# EAGLE design LED_control (EAGLE 7.7.0)
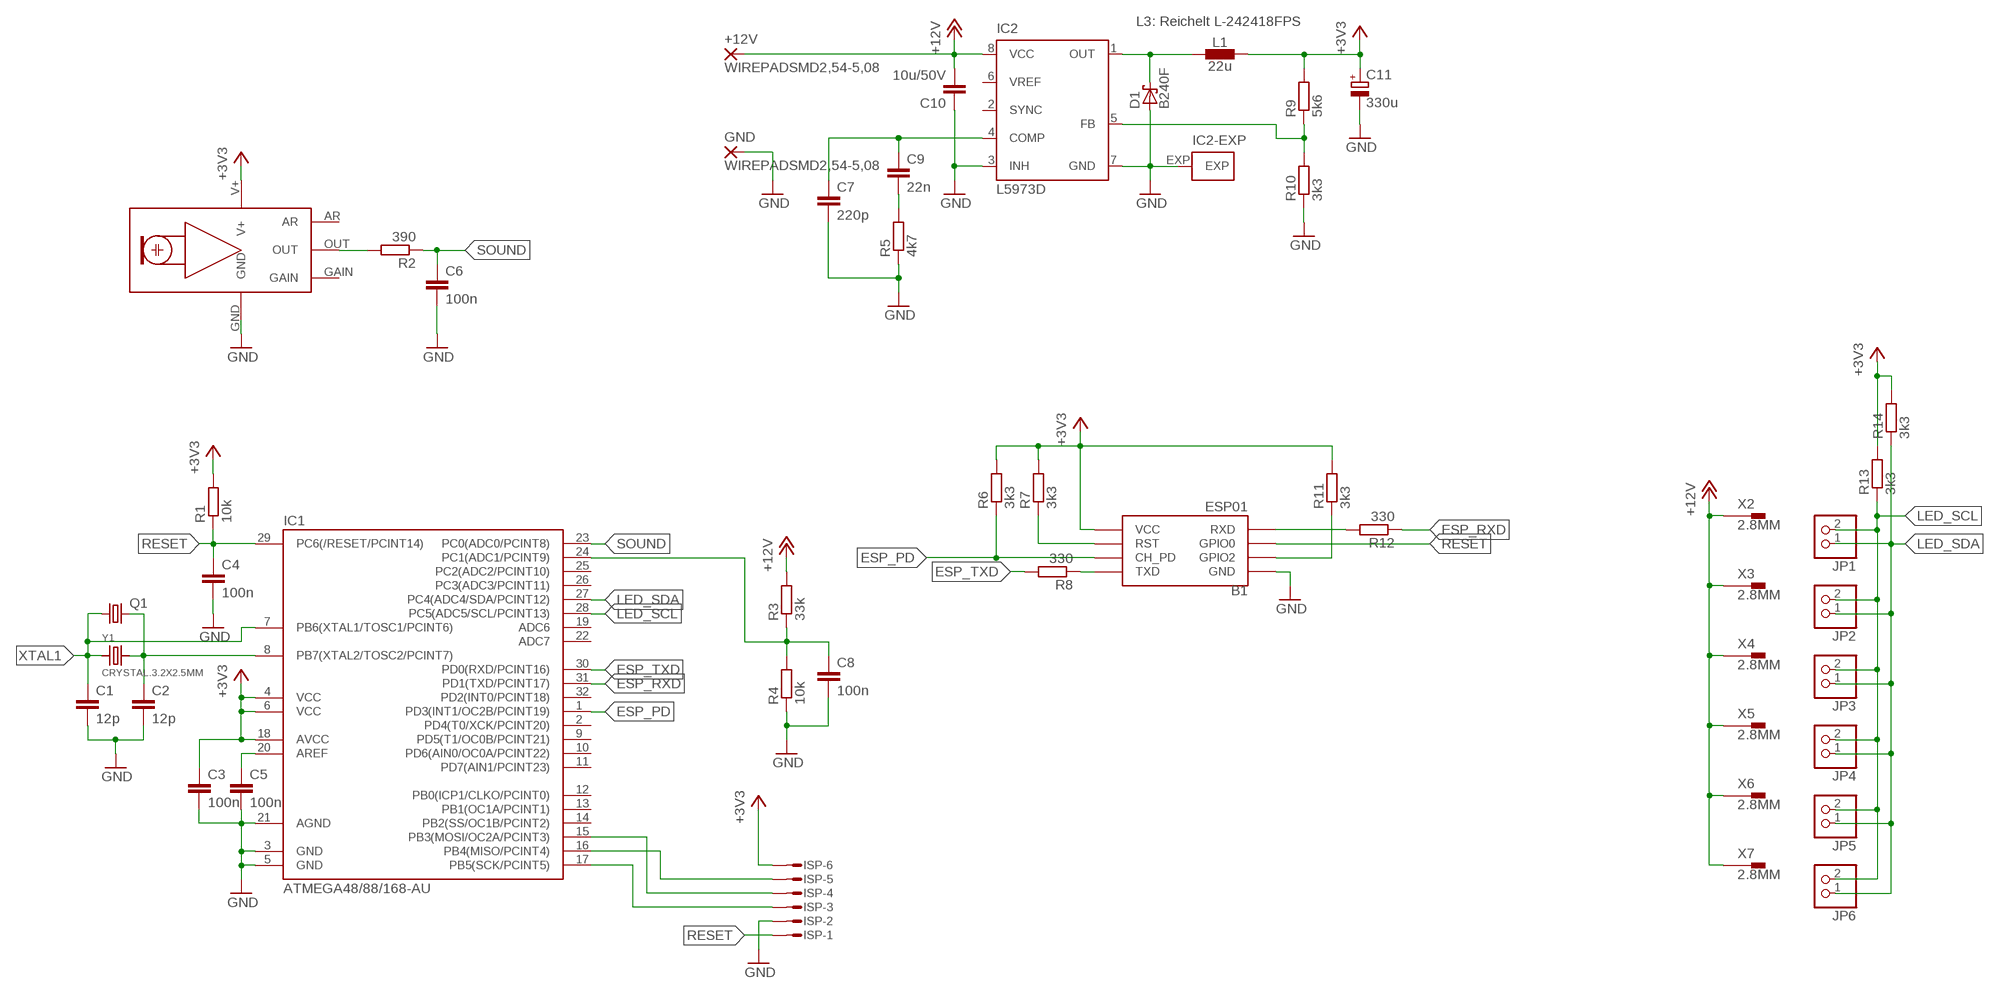
[diagram p0: schematic, sheet 1]

## Parts
+12V  WIREPADSMD2,54-5,08  [SMD2,54-5,08]
B1  ESP01  [ESP01]
C1  12p  C-EUC0603K  [C0603K]
C2  12p  C-EUC0603K  [C0603K]
C3  100n  C-EUC0603K  [C0603K]
C4  100n  C-EUC0603  [C0603]
C5  100n  C-EUC0603K  [C0603K]
C6  100n  C-EUC0603K  [C0603K]
C7  220p  C-EUC0603  [C0603]
C8  100n  C-EUC0603  [C0603]
C9  22n  C-EUC0603  [C0603]
C10  10u/50V  C-EUC1206  [C1206]
C11  330u  CPOL-EU153CLV-0605  [153CLV-0605]
D1  B240F  SCHOTTKY-DIODESMD  [SMB]
GND  WIREPADSMD2,54-5,08  [SMD2,54-5,08]
IC1  ATMEGA48/88/168-AU  [TQFP32-08]
IC2  L5973D  [HSOP8]
ISP  MICROMATCH-6SMF  [MMT-F-SMD-6]
JP1  PINHD-1X2/90  [1X02/90]
JP2  PINHD-1X2/90  [1X02/90]
JP3  PINHD-1X2/90  [1X02/90]
JP4  PINHD-1X2/90  [1X02/90]
JP5  PINHD-1X2/90  [1X02/90]
JP6  PINHD-1X2/90  [1X02/90]
L1  22u  INDUCTOR-NR60XX  [L_NR60XX]
PCB1  MAX9814_AGC_MIC  [MAX9814_AGC_MIC]
Q1  CRYSTALHC49S  [HC49/S]
R1  10k  R-EU_R0603  [R0603]
R2  390  R-EU_R0603  [R0603]
R3  33k  R-EU_R0603  [R0603]
R4  10k  R-EU_R0603  [R0603]
R5  4k7  R-EU_R0603  [R0603]
R6  3k3  R-EU_R0603  [R0603]
R7  3k3  R-EU_R0603  [R0603]
R8  330  R-EU_R0603  [R0603]
R9  5k6  R-EU_R0603  [R0603]
R10  3k3  R-EU_R0603  [R0603]
R11  3k3  R-EU_R0603  [R0603]
R12  330  R-EU_R0603  [R0603]
R13  3k3  R-EU_R0603  [R0603]
R14  3k3  R-EU_R0603  [R0603]
X2  2.8MM  [2.8_90]
X3  2.8MM  [2.8_90]
X4  2.8MM  [2.8_90]
X5  2.8MM  [2.8_90]
X6  2.8MM  [2.8_90]
X7  2.8MM  [2.8_90]
Y1  CRYSTAL.3.2X2.5MM  [3.2X2.5MM]

## Nets
+3V3: B1.VCC C3.1 C11.+ IC1.4(VCC) IC1.6(VCC) IC1.18(AVCC) ISP.6 L1.2 PCB1.V+ R1.2 R6.2 R7.2 R9.2 R11.2 R13.2 R14.2
+12V: +12V.1(P) C10.2 IC2.8(VCC) R3.2 X2.1A X2.1B X3.1A X3.1B X4.1A X4.1B X5.1A X5.1B X6.1A X6.1B X7.1A X7.1B
ESP_GPIO2: B1.GPIO2 R11.1
ESP_PD: B1.CH_PD IC1.1(PD3(INT1/OC2B/PCINT19)) R6.1
ESP_RST: B1.RST R7.1
ESP_RXD: IC1.31(PD1(TXD/PCINT17)) R12.1
ESP_TXD: IC1.30(PD0(RXD/PCINT16)) R8.2
GND: B1.GND C1.2 C2.2 C3.2 C4.2 C5.2 C6.2 C7.2 C8.2 C10.1 C11.- D1.A GND.1(P) IC1.3(GND) IC1.5(GND) IC1.21(AGND) IC2.3(INH) IC2.7(GND) IC2.EXP ISP.2 PCB1.GND R4.1 R5.1 R10.1
LED_SCL: IC1.28(PC5(ADC5/SCL/PCINT13)) JP1.2 JP2.2 JP3.2 JP4.2 JP5.2 JP6.2 R13.1
LED_SDA: IC1.27(PC4(ADC4/SDA/PCINT12)) JP1.1 JP2.1 JP3.1 JP4.1 JP5.1 JP6.1 R14.1
MISO: IC1.16(PB4(MISO/PCINT4)) ISP.5
MOSI: IC1.15(PB3(MOSI/OC2A/PCINT3)) ISP.4
N$1: B1.RX(RXD) R12.2
N$2: B1.TX(TXD) R8.1
N$3: C5.1 IC1.20(AREF)
N$5: PCB1.OUT R2.2
N$6: C8.1 IC1.24(PC1(ADC1/PCINT9)) R3.1 R4.2
N$30: C7.1 C9.1 IC2.4(COMP)
N$49: C9.2 R5.2
N$52: D1.C IC2.1(OUT) L1.1
N$54: IC2.5(FB) R9.1 R10.2
RESET: B1.GPIO0 C4.1 IC1.29(PC6(/RESET/PCINT14)) ISP.1 R1.1
SCK: IC1.17(PB5(SCK/PCINT5)) ISP.3
SOUND: C6.1 IC1.23(PC0(ADC0/PCINT8)) R2.1
XTAL1: C1.1 IC1.7(PB6(XTAL1/TOSC1/PCINT6)) Q1.1 Y1.1
XTAL2: C2.1 IC1.8(PB7(XTAL2/TOSC2/PCINT7)) Q1.2 Y1.3
Unconnected: IC1.2(PD4(T0/XCK/PCINT20)) IC1.9(PD5(T1/OC0B/PCINT21)) IC1.10(PD6(AIN0/OC0A/PCINT22)) IC1.11(PD7(AIN1/PCINT23)) IC1.12(PB0(ICP1/CLKO/PCINT0)) IC1.13(PB1(OC1A/PCINT1)) IC1.14(PB2(SS/OC1B/PCINT2)) IC1.19(ADC6) IC1.22(ADC7) IC1.25(PC2(ADC2/PCINT10)) IC1.26(PC3(ADC3/PCINT11)) IC1.32(PD2(INT0/PCINT18)) IC2.2(SYNC) IC2.6(VREF) PCB1.AR PCB1.GAIN

## Notes on the sheet
- L3: Reichelt L-242418FPS

## Library data of the parts
+12V GND = wirepad:WIREPAD: Wire PAD connect wire on PCB
B1 = esp8266modules:ESP01: ESP8266 Wifi module 01
C1 C2 C7 C9 C10 = rcl:C-EU: CAPACITOR, European symbol
C3-C6 C8 = resistor:C-EU: CAPACITOR, European symbol
C11 = resistor:CPOL-EU: POLARIZED CAPACITOR, European symbol
D1 = diode:SCHOTTKY-DIODE: Schottky Diode
IC1 = atmega8:ATMEGA48/88/168
IC2 = st-microelectronics:L5973D: 2.5 A switch step down switching regulator Source: Data sheet <http://www.st.com/internet/com/TECHNICAL_RESOURCES/TECHNICAL_LITERATURE/DATASHEET/CD00002851.pdf>; MF: STMICROELECTRONICS; MPN: L5973D; OC_FARNELL: 1077145
ISP = con-amp-micromatch2:MICROMATCH-6: MicroMaTch 6 7-215464-6 / 0-215464-6 Drawing Number C-215464 DDEController.pdf
JP1-JP6 = pinhead:PINHD-1X2: PIN HEADER
L1 = we-power:INDUCTOR: Power Inductors Taiyo Yuden NR6028 NR6028T0R9N - 0.9uH, Ir=6.6A NR6028T1R5N - 1.5uH, Ir=5.0A NR6028T2R2N - 2.2uH, Ir=4.2A NR6028T3R0N - 3.0uH, Ir=3.6A NR6028T4R7M - 4.7uH, Ir=2.7A NR6028T6R0M - 6.0uH, Ir=2.5A NR6028T100M - 10uH, Ir=1.9A NR6028T150M - 15uH, Ir=1.6A NR6028T220M - 22uH, Ir=1.3A NR6028T330M - 33uH, Ir=1.1A NR6028T470M - 47uH, Ir=0.95A NR6028T680M - 68uH, Ir=0.76A NR6028T101M - 100uH, Ir=0.62A Taiyo Yuden NR6045 NR6045T1R0N - 1.0uH, Ir=8.5A NR6045T1R3N - 1.3uH, Ir=8.0A NR6045T1R8N - 1.8uH, Ir=7.0A NR6045T2R3N - 2.3uH, Ir=6.0A NR6045T3R0N - 3.0uH, Ir=5.0A NR6045T4R5M - 4.5uH, Ir=4.0A NR6045T6R3M - 6.3uH, Ir=3.8A NR6045T100M - 10uH, Ir=3.0A NR6045T150M - 15uH, Ir=2.3A NR6045T220M - 22uH, Ir=1.9A NR6045T330M - 33uH, Ir=1.5A NR6045T470M - 47uH, Ir=1.3A NR6045T680M - 68uH, Ir=1.0A NR6045T101M - 100uH, Ir=0.8A
PCB1 = adafruit:MAX9814_AGC_MIC
Q1 = crystal:CRYSTAL: CRYSTAL; OC_FARNELL: 1667008; OC_NEWARK: unknown
R1-R14 = resistor:R-EU_: RESISTOR, European symbol
X2-X7 = faston_flachstecker:2.8MM
Y1 = abracon:CRYSTAL

## Board
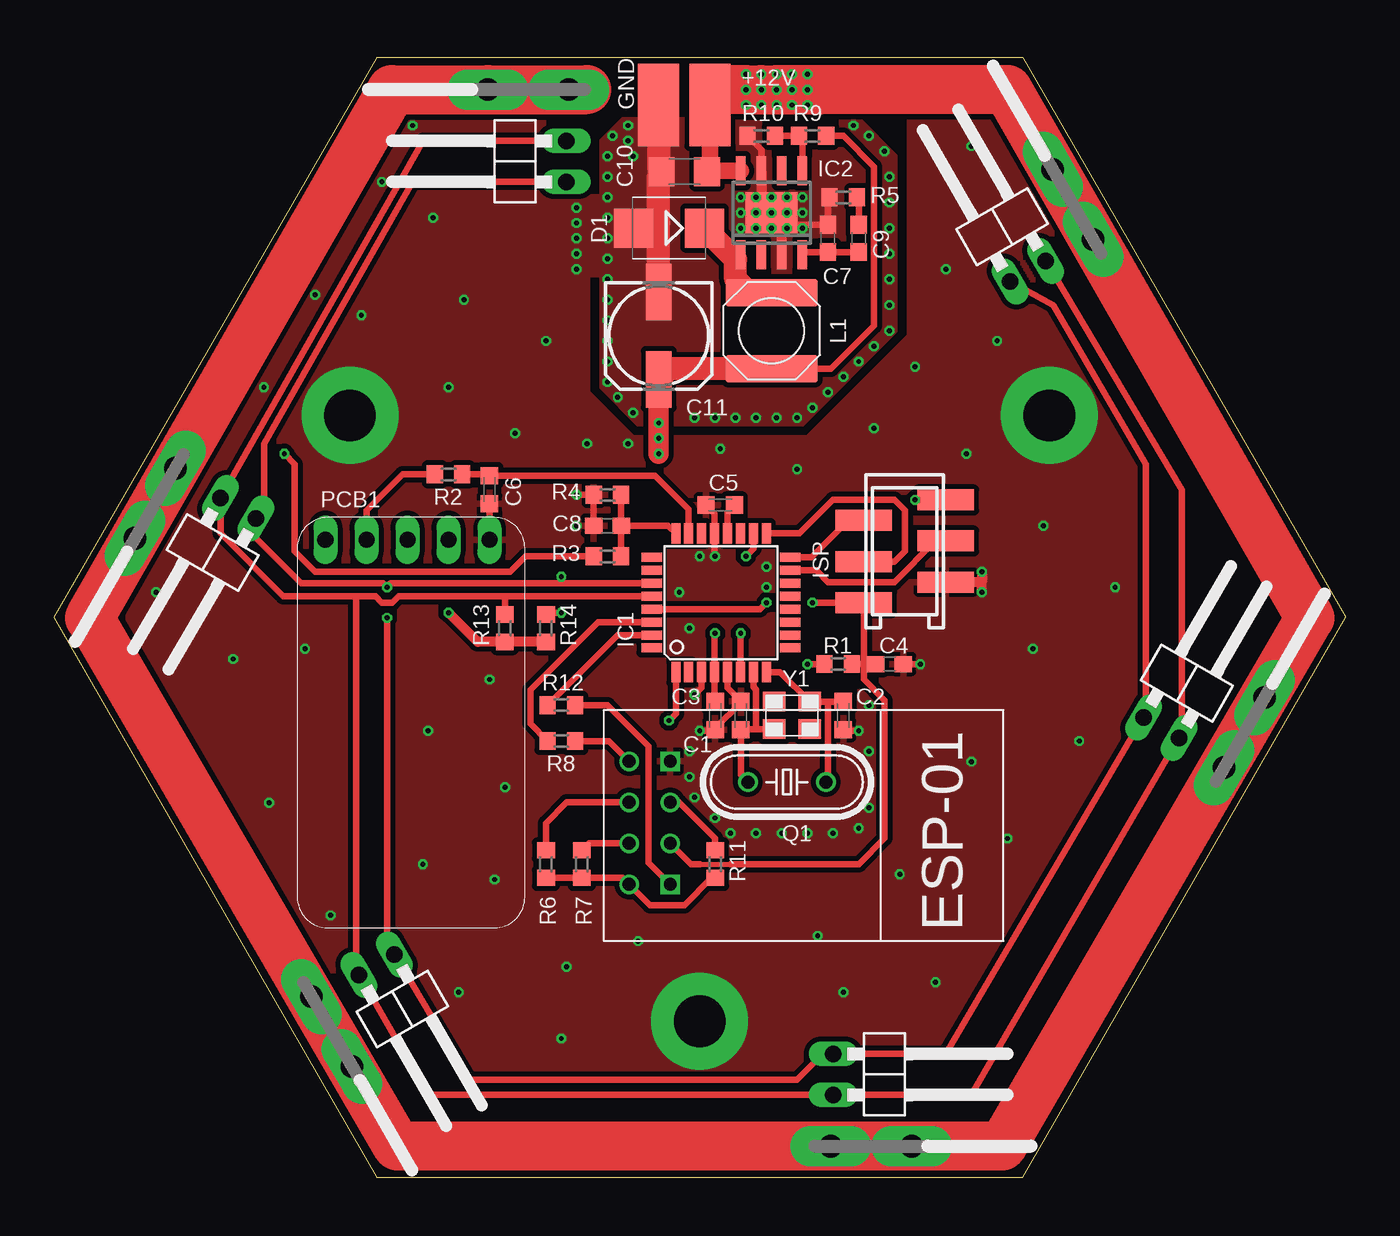
[diagram p1: board, top side]
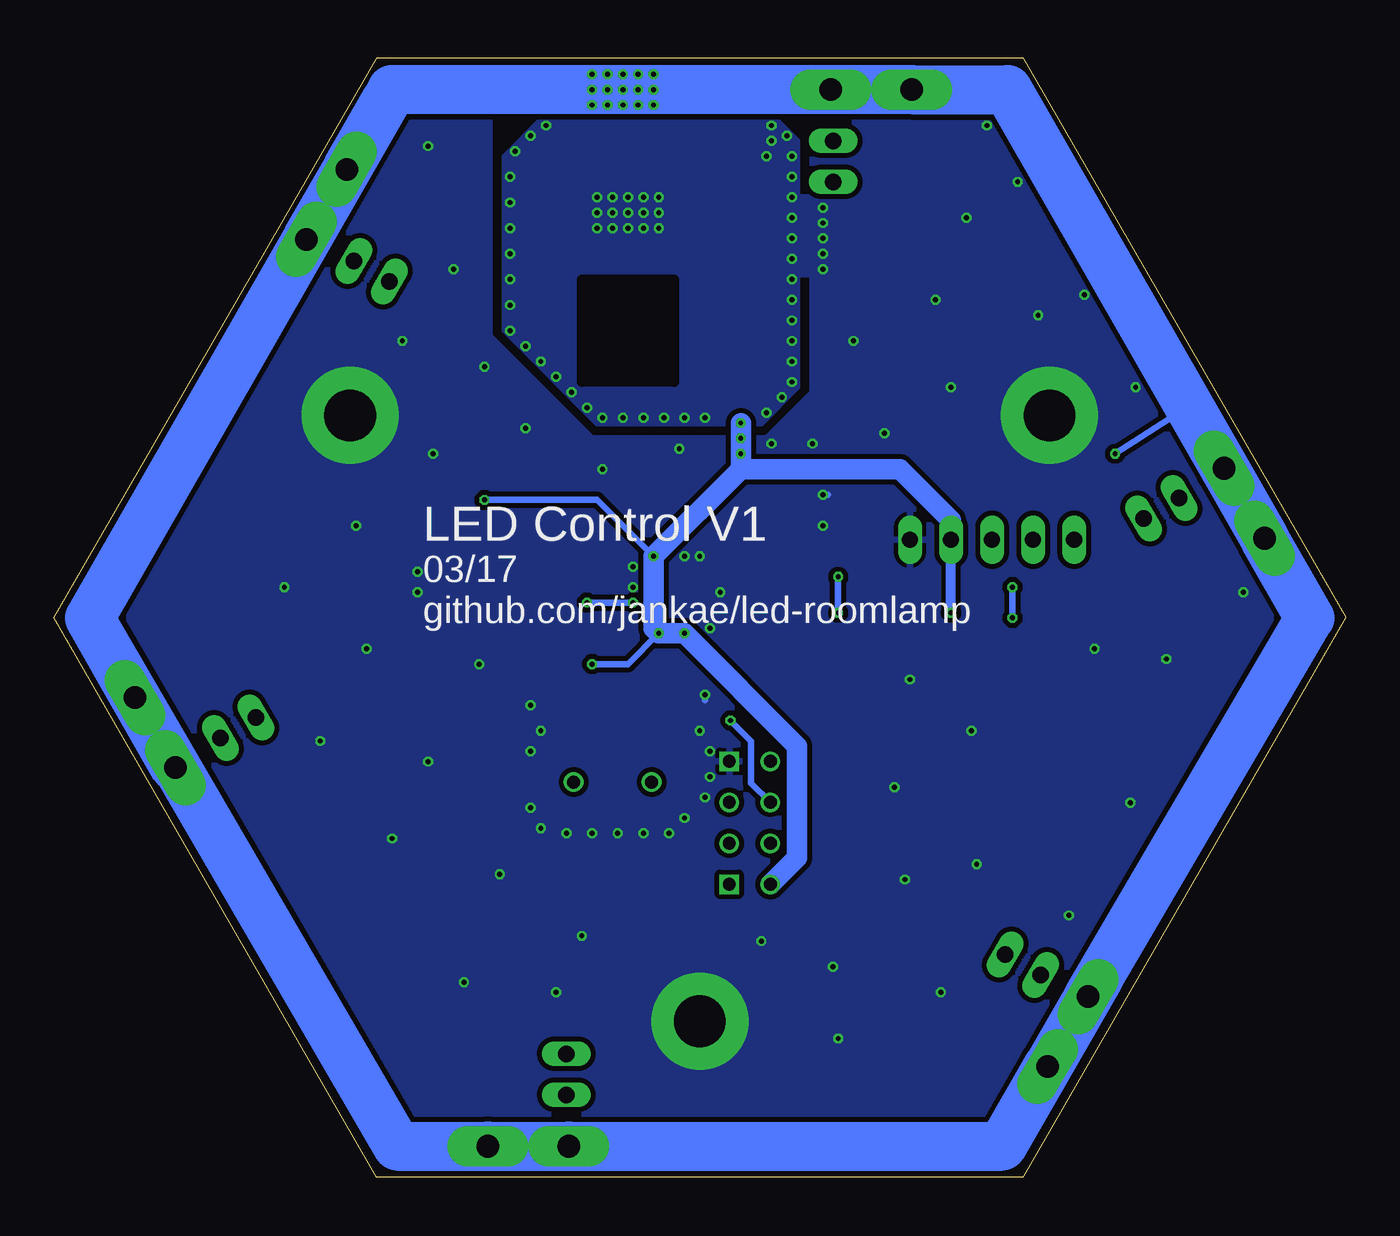
[diagram p2: board, bottom side, seen from below]

Size 80 x 69.28 mm. Coordinates in mm from the lower left corner, seen from the top.
Outline: 20,0 60,0 80,34.64 60,69.28 20,69.28 0,34.64 20,0
Copper layers (1*16): Top 0.035mm / dielectric 1.6mm / Bottom 0.035mm
Design rules "Elecrow_2-layer_PCB_eagle_rule": minimum track width 6mil, minimum drill 12mil, track to track 6mil, track to pad 6mil, pad to pad 6mil, via to via 8mil, smd to smd 0mil, copper to edge 20mil, drill to drill 10mil, minimum pad ring 6mil, minimum via ring 6mil, stop-mask expansion 0mil, vias tented up to drill 100mil, thermal gap 10mil
tRestrict: area 41.6,51.1 to 47.3,53.7
bRestrict: area 41.6,49.2 to 47.3,55.6

### Footprints (pad centres in the part's own frame; a part is rotated, then mirrored left to right if it is on the bottom)
SMD2,54-5,08 = smd 2.54 x 5.08: 1 0,0
ESP01 = drill 0.8: CH_PD -1.285,-8.178; GPIO0 1.255,-5.638; GPIO2 -1.285,-5.638; RST 1.255,-8.178; TX -3.825,-8.178; VCC 3.795,-8.178 | drill 0.8 square: GND -3.825,-5.638; RX 3.795,-5.638
C0603K = smd 1.05 x 1.08: 1 -0.875,0; 2 0.875,0
C0603 = smd 1.1 x 1: 1 -0.85,0; 2 0.85,0
C1206 = smd 1.6 x 1.8: 1 -1.4,0; 2 1.4,0
153CLV-0605 = smd 3.5 x 1.6: + 2.7,0; - -2.7,0
SMB = smd 2.4 x 2.4: A 2.2,0; C -2.2,0
TQFP32-08 = smd 1.27 x 0.559: 1 -4.293,2.8; 2 -4.293,2; 3 -4.293,1.2; 4 -4.293,0.4; 5 -4.293,-0.4; 6 -4.293,-1.2; 7 -4.293,-2; 8 -4.293,-2.8; 17 4.293,-2.8; 18 4.293,-2; 19 4.293,-1.2; 20 4.293,-0.4; 21 4.293,0.4; 22 4.293,1.2; 23 4.293,2; 24 4.293,2.8 | smd 0.559 x 1.27: 9 -2.8,-4.293; 10 -2,-4.293; 11 -1.2,-4.293; 12 -0.4,-4.293; 13 0.4,-4.293; 14 1.2,-4.293; 15 2,-4.293; 16 2.8,-4.293; 25 2.8,4.293; 26 2,4.293; 27 1.2,4.293; 28 0.4,4.293; 29 -0.4,4.293; 30 -1.2,4.293; 31 -2,4.293; 32 -2.8,4.293
HSOP8 = smd 0.6 x 1.8: 1 -1.905,-2.6; 2 -0.635,-2.6; 3 0.635,-2.6; 4 1.905,-2.6; 5 1.905,2.6; 6 0.635,2.6; 7 -0.635,2.6; 8 -1.905,2.6 | smd 3.2 x 2.51: EXP 0,0
MMT-F-SMD-6 = smd 1.3 x 3.5: 1 3.175,-2.54; 2 1.905,2.54; 3 0.635,-2.54; 4 -0.635,2.54; 5 -1.905,-2.54; 6 -3.175,2.54
1X02/90 = drill 1.016 long: 1 -1.27,-3.81; 2 1.27,-3.81
L_NR60XX = smd 5.7 x 1.7: 1 0,2.35; 2 0,-2.35
MAX9814_AGC_MIC = drill 1 long: AR -11.827,-5.239; GAIN -11.827,-0.159; GND -11.827,4.921; OUT -11.827,-2.699; V+ -11.827,2.381
HC49/S = drill 0.813: 1 -2.413,0; 2 2.413,0
R0603 = smd 1 x 1.1: 1 -0.85,0; 2 0.85,0
2.8_90 = drill 1.4 pad 2.5 long: 1A -3,0; 1B 2,0
3.2X2.5MM = smd 1.4 x 1.2: 1 -1.1,-0.85; 2 1.1,-0.85; 3 1.1,0.85; 4 -1.1,0.85

### Placement (x,y rotation side)
+12V  40.64,66.36 0 top
B1  43.81,21.91 270 top
C1  42.55,28.57 90 top
C2  48.9,28.57 270 top
C3  40.96,28.57 270 top
C4  51.75,31.75 0 top
C5  41.27,41.59 180 top
C6  26.99,42.55 270 top
C7  47.94,58.1 90 top
C8  34.29,40.32 180 top
C9  49.85,58.1 90 top
C10  39.05,62.23 0 top
C11  37.47,52.07 270 top
D1  38.1,58.74 180 top
GND  37.47,66.36 0 top
IC1  41.32,35.55 90 top
IC2  44.45,59.69 0 top
ISP  52.7,38.73 270 top
JP1  27.94,62.87 90 top
JP2  58.42,59.37 30 top
JP3  70.48,31.11 330 top
JP4  52.07,6.35 270 top
JP5  21.91,9.84 210 top
JP6  9.53,38.1 150 top
L1  44.45,52.39 0 top
PCB1  22.07,27.62 270 top
Q1  45.4,24.45 0 top
R1  48.58,31.75 180 top
R2  24.45,43.5 180 top
R3  34.29,38.42 180 top
R4  34.29,42.23 0 top
R5  48.9,60.64 0 top
R6  30.48,19.37 270 top
R7  32.7,19.37 270 top
R8  31.43,26.99 180 top
R9  46.99,64.45 0 top
R10  43.81,64.45 0 top
R11  40.96,19.37 270 top
R12  31.43,29.21 0 top
R13  27.94,33.97 270 top
R14  30.48,33.97 270 top
X2  28.89,67.31 180 top
X3  62.87,60.64 120 top
X4  73.98,27.94 60 top
X5  51.12,1.91 0 top
X6  17.46,8.57 300 top
X7  6.03,41.27 240 top
Y1  45.72,28.57 0 top

### Tracks (layer width: path | path; a pad name or v marks a point on that pad's centre or on a via)
+3V3  (via drill 0.3)
  Top 0.406: L1.2 48.13,50.04 50.8,52.7 50.8,62.55 48.9,64.45 R9.2 | C3.1 40.92,29.48 IC1.4 40.92,33.62 v40.96,33.66 | IC1.6 42.52,33.63 v42.55,33.66 | IC1.18 43.32,38.88 v42.86,38.42 | ISP.6 v53.34,41.91 | R6.2 R7.2 35.23,18.52 B1.VCC 36.92,16.83 39.05,16.83 40.74,18.52 R11.2 | R1.2 v46.67,31.75
  Top 0.61: R14.2 R13.2 26.25,33.12 v24.45,34.92
  Top 1.27: C11.+ v37.47,45.72 v37.47,44.77
  Top 1.422: L1.2 37.91,50.04 37.78,50.16 37.78,49.69 C11.+
  Bottom 0.406: v53.34,41.91 46.35,41.91 v42.86,38.42 | v46.67,31.75 44.45,31.75 v42.55,33.66
  Bottom 0.61: v24.45,34.92 PCB1.V+
  Bottom 1.27: 37.47,44.13 v37.47,45.72 v37.47,46.67 | 37.47,44.13 37.47,43.81 v42.86,38.42 42.86,33.97 v42.55,33.66 v40.96,33.66 33.97,26.67 33.97,19.78 B1.VCC | PCB1.V+ 24.45,40.64 27.62,43.81 37.15,43.81 37.47,44.13
+12V  (via drill 0.3)
  Top 0.406: v42.86,66.36 v42.86,67.31 v42.86,68.26 | v45.72,68.26 v45.72,67.31 v45.72,66.36 v44.77,66.36 | v46.67,68.26 v46.67,67.31 | v46.67,67.31 v44.77,67.31 v44.77,68.26 v43.81,68.26 | v42.86,66.36 v43.81,66.36 | v46.67,66.36 v46.67,67.31 | v42.86,66.36 +12V.1 | R3.2 29.21,38.42 28.26,37.47 16.19,37.47 14.92,38.73 14.92,44.13 v14.29,44.77
  Top 1.016: IC2.8 40.51,62.29 | 40.51,62.29 C10.2 | 40.51,62.29 40.64,62.42 +12V.1
  Top 3.048: v42.86,67.31 v43.81,67.31 v44.77,67.31 | v44.77,67.31 v45.72,67.31 v46.67,67.31 47.62,67.31 | v42.86,67.31 v44.77,67.31 | v44.77,67.31 59.05,67.31 77.79,34.61 58.74,1.91 21.27,1.91 2.22,34.61 9.37,47.08 20.95,67.31 X2.1B 33.02,67.31 | v42.86,67.31 41.27,67.31
  Bottom 0.406: v14.29,44.77 9.72,47.7 9.78,47.8 9.31,46.98 9.29,46.94 9.66,47.59 X7.1A
  Bottom 3.048: X6.1A 2.22,34.61 X7.1B X7.1A 20.95,67.31 X2.1B X2.1A v45.72,67.31 v46.67,67.31 59.05,67.31 59.47,66.59 | 59.47,66.59 77.79,34.61 | 77.79,34.61 58.74,1.91 X5.1B X5.1A 21.27,1.91 | 21.27,1.91 X6.1B | X4.1A 77.79,34.61 | X4.1B 77.79,34.61 | X3.1A X3.1B 59.47,66.59 | 21.27,1.91 15.24,12.38
ESP_GPIO2
  Top 0.406: B1.GPIO2 38.72,23.19 40.96,20.95 R11.1
ESP_PD  (via drill 0.3)
  Top 0.406: B1.CH_PD 31.77,23.19 30.48,21.91 R6.1 | v38.1,28.26 38.52,28.68 IC1.1
  Bottom 0.406: B1.CH_PD 36.83,24.39 36.83,26.99 v38.1,28.26
ESP_RST
  Top 0.406: B1.RST 33.14,20.65 R7.1
ESP_RXD
  Top 0.406: IC1.31 34.92,33.55 R12.1
ESP_TXD
  Top 0.406: IC1.30 33.72,34.35 29.53,30.16 29.53,28.04 R8.2
GND  (via drill 0.3, 3.2 pad 6)
  Top 0.406: IC2.7 43.81,63.6 R10.1 | R5.1 47.94,60.54 C7.2 45.3,58.95 45.09,58.74 | 40.96,27.78 42.55,29.37 C1.2 41.72,30.27 IC1.5 | 40.96,27.78 C3.2 | C5.2 40.92,41.07 IC1.21 40.92,38.45 v40.96,38.42 | PCB1.GND C6.2 | C8.2 R4.1 v32.38,42.23 | IC1.3 40.12,30.28 v39.69,29.84 | C2.2 48.97,27.62 v49.85,27.62 | 40.96,27.78 40.8,27.62 v40.01,27.62 | C4.2 v53.66,31.75
  Top 0.61: IC2.3 45.09,58.74 45.09,59.05 IC2.EXP 43.81,60.33 IC2.7 | v57.47,37.47 57.47,36.83 | v57.47,36.2 57.47,36.83 | 57.47,36.83 ISP.2
  Top 1.422: C11.- 37.47,59.05 | 37.47,59.05 37.47,62.04 C10.1 37.47,62.42 GND.1 | D1.A 37.15,58.74 37.47,59.05
  Bottom 0.406: v32.38,42.23 32.07,42.23 | v39.69,29.84 39.69,29.53
  other vias: 35.56,65.09 35.56,64.14 35.88,63.18 44.45,59.69 45.4,59.69 46.35,59.69 43.5,59.69 42.55,59.69 42.55,60.64 43.5,60.64 44.45,60.64 45.4,60.64 46.35,60.64 45.4,58.74 46.35,58.74 44.45,58.74 43.5,58.74 42.55,58.74 34.61,64.45 34.29,63.18 34.29,61.91 34.29,60.64 34.29,59.37 34.29,58.1 34.29,56.83 34.29,55.56 34.29,54.29 34.29,53.02 34.29,51.75 34.29,50.48 34.29,49.21 34.92,48.26 35.88,47.31 39.69,46.99 40.96,46.99 42.23,46.99 43.5,46.99 44.77,46.99 46.04,46.99 46.99,47.62 47.94,48.58 48.9,49.53 49.85,50.48 50.8,51.44 51.75,52.39 51.75,53.98 51.75,55.56 51.75,57.15 51.75,58.74 51.75,60.33 51.75,61.91 51.44,63.5 50.48,64.45 49.53,65.09 39.37,26.35 39.37,24.77 39.69,23.5 40.96,22.23 41.91,21.27 43.5,21.27 45.09,21.27 46.67,21.27 48.26,21.27 49.85,21.59 50.48,22.86 50.48,26.35 50.48,29.21 40.01,38.42 39.37,33.97 38.73,36.2 44.13,36.51 44.13,37.78 32.38,40.32 18.35,47.14 61.65,47.14 40,9.64 32.38,60.01 32.38,59.05 32.38,58.1 32.38,57.15 32.38,56.2 35.56,45.4 33.02,45.4 28.57,46.04 25.4,54.29 23.5,59.37 19.05,53.34 24.45,48.9 30.48,51.75 56.83,63.82 55.24,56.2 53.34,50.16 58.42,51.75 50.8,46.35 41.27,45.09 46.04,43.81 56.52,44.77 61.28,40.32 65.72,36.51 60.64,32.7 63.5,26.99 56.83,25.72 59.05,20.95 52.39,18.73 54.61,12.06 47.31,14.92 48.9,11.43 36.2,14.61 31.43,8.57 31.75,13.02 25.08,11.43 27.3,18.41 22.86,19.37 27.94,24.13 23.18,27.62 26.99,30.8 15.56,32.7 11.11,32.07 13.34,23.18 17.14,16.19 6.35,36.2 13.02,48.9 16.19,54.61 20.32,61.59 22.23,65.09
  pour Top (isolate 0.305, no thermals): 49.85,65.41 35.24,65.41 33.97,64.14 33.97,48.9 36.2,46.67 46.35,46.67 52.07,52.39 52.07,63.18
  pour Bottom (isolate 0.305, no thermals): 49.85,65.41 35.24,65.41 33.97,64.14 33.97,48.9 36.2,46.67 46.35,46.67 52.07,52.39 52.07,63.18
  pour Bottom (isolate 0.305): 33.02,65.41 21.91,65.41 4.13,34.61 22.23,3.49 57.78,3.49 75.88,34.61 58.1,65.72 53.02,65.72 53.02,52.07 46.67,45.72 35.88,45.72 33.02,48.58 33.02,55.88 34.92,55.88 34.92,60.64 33.02,60.64
  pour Top (isolate 0.305): 33.02,65.41 21.91,65.41 4.13,34.61 22.23,3.49 57.78,3.49 75.88,34.61 58.1,65.72 53.02,65.72 53.02,52.07 46.67,45.72 35.88,45.72 33.02,48.58 33.02,55.88 34.92,55.88 34.92,60.64 33.02,60.64
LED_SCL
  Top 0.406: IC1.28 27.94,35.95 | 18.73,35.95 14.21,35.95 | 14.21,35.95 10.33,39.84 JP6.2 22.86,64.14 JP1.2 | R13.1 27.94,35.95 | JP2.2 69.85,42.55 69.85,27.35 JP3.2 56.83,5.08 JP4.2 23.18,5.08 JP5.2 18.73,12.68 18.73,35.95 | 27.94,35.95 21.34,35.95 20.95,35.56 20.32,35.56 19.93,35.95 18.73,35.95 | 18.73,35.95 14.21,35.95
LED_SDA  (via drill 0.3)
  Top 0.406: IC1.27 31.43,36.75 | R14.1 30.58,34.92 v31.43,34.92 | v31.43,37.15 31.43,36.75 | JP1.1 22.23,61.59 13.02,45.4 13.02,41.25 JP6.1 12.53,39.54 15.32,36.75 20.4,36.75 v20.64,36.51 20.88,36.75 31.43,36.75 | JP2.1 61.91,53.98 67.63,44.13 67.63,28.6 JP3.1 55.24,7.62 JP4.1 47.62,7.62 46.04,6.03 25.72,6.03 JP5.1 20.64,14.24 v20.64,34.61
  Bottom 0.406: v31.43,34.92 v31.43,37.15 | v20.64,36.51 v20.64,34.61
MISO
  Top 0.406: IC1.16 46.92,38.35 49.21,40.64 ISP.5
MOSI
  Top 0.406: IC1.15 47.22,37.55 47.94,36.83 52.07,36.83 54.61,39.37 ISP.4
N$1
  Top 0.406: R12.2 34.29,29.21 36.83,26.67 36.83,19.46 B1.RX
N$2
  Top 0.406: R8.1 34.38,26.99 B1.TX
N$3
  Top 0.406: IC1.20 41.72,41.16 C5.1
N$5
  Top 0.406: R2.2 21.59,43.5 19.37,41.27 PCB1.OUT
N$6
  Top 0.406: IC1.24 38.04,40.32 C8.1 | R4.2 C8.1 | C8.1 R3.1
N$30
  Top 0.406: C9.1 C7.1 46.52,57.25 IC2.4
N$49
  Top 0.406: C9.2 49.85,60.54 R5.2
N$52
  Top 0.406: IC2.1 42.51,57.09 42.23,56.81
  Top 1.422: L1.1 43.05,54.74 42.23,55.56 42.23,56.81 D1.C
N$54
  Top 0.406: R10.2 R9.1 46.35,64.24 IC2.5
RESET  (via drill 0.3)
  Top 0.305: 40.01,19.37 41.91,19.37
  Top 0.406: IC1.29 43.72,35.15 v44.13,35.56 | v46.99,35.56 ISP.1 50.16,31.75 | C4.1 50.16,31.75 | 50.16,31.75 R1.1 | B1.GPIO0 39.46,19.37 40.01,19.37 | 41.91,19.37 49.85,19.37 51.44,20.95 51.44,29.53 50.16,30.8 50.16,31.75
  Bottom 0.406: v44.13,35.56 v46.99,35.56
SCK
  Top 0.406: IC1.17 46.19,39.84 48.26,41.91 52.07,41.91 52.7,41.27 52.7,38.73 52.07,38.1 ISP.3
SOUND
  Top 0.406: R2.1 26.91,43.5 C6.1 37.23,43.42 39.32,41.32 IC1.23
XTAL1
  Top 0.406: IC1.7 43.32,30.34 43.5,30.16 43.5,27.73 | Y1.1 43.5,27.73 | 43.5,27.73 42.57,27.73 C1.1 42.55,24.89 Q1.1
XTAL2
  Top 0.406: IC1.8 44.99,31.26 Y1.3 47.94,29.43 | 47.94,29.43 48.87,29.43 C2.1 | Q1.2 47.94,24.57 47.94,29.43

### Text on the board
bPlace: LED Control V1 | 03/17 | github.com/jankae/led-roomlamp